# Altium schematic sheet RF.SchDoc: STM32WB55RG RF part
size A4; Author: PhA; SheetNumber: 3; SheetTotal: 6
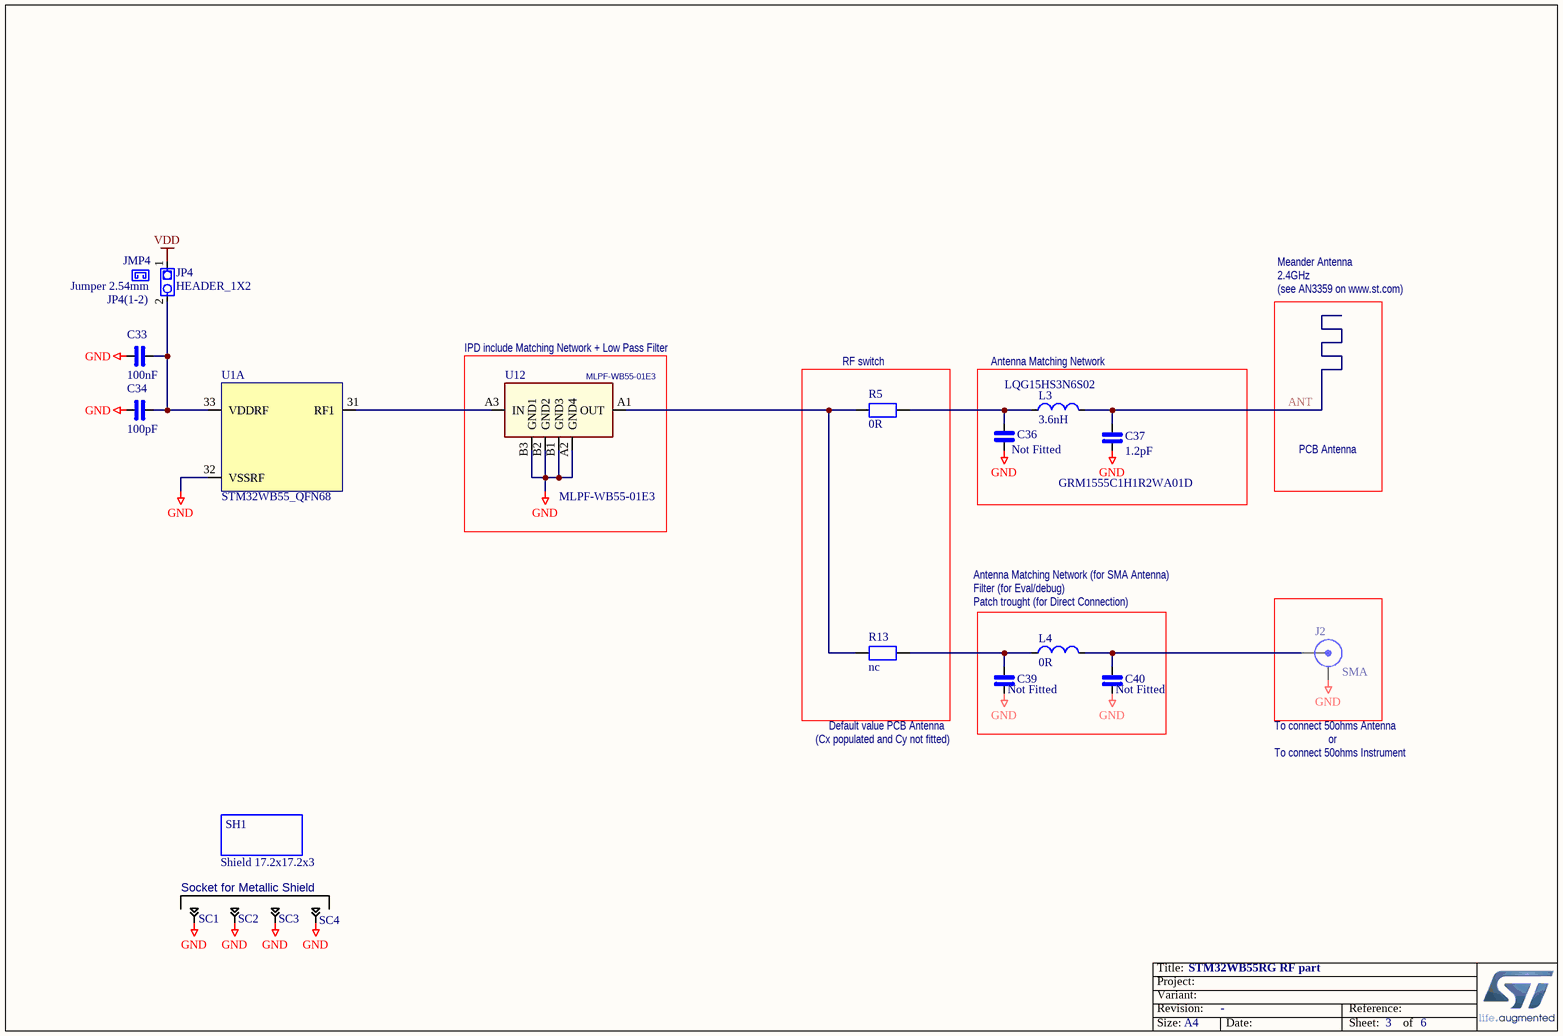
[diagram p0: RF.SchDoc]

## Parts
C33  100nF  [0402_CAP_NPOL]
C34  100pF  [0402_CAP_NPOL]
C36  Fitted: Not Fitted  [0402_CAP_NPOL]
C37  1.2pF  Ref: GRM1555C1H1R2WA01D  [0402_CAP_NPOL]
C39  Fitted: Not Fitted  [0402_CAP_NPOL]
C40  Fitted: Not Fitted  [0402_CAP_NPOL]
J2  SMA  [SMA_T_9.52_NF]
JMP4  Jumper 2.54mm  default: JP4(1-2)  [Jumper 2.54mm BLACK]
JP4  HEADER_1X2  [Header M 1x2x2.54 TH V]
L3  3.6nH  Ref: LQG15HS3N6S02  [0402_COIL]
L4  0R  [0402_COIL]
R5  0R  [0402_RES]
R13  nc  [0402_RES]
SC1  Shield Clip_A 3.9x1.1x1.28  [Shield Clip_A 3.9x1.1x1.28]  (value not drawn)
SC2  Shield Clip_A 3.9x1.1x1.28  [Shield Clip_A 3.9x1.1x1.28]  (value not drawn)
SC3  Shield Clip_A 3.9x1.1x1.28  [Shield Clip_A 3.9x1.1x1.28]  (value not drawn)
SC4  Shield Clip_A 3.9x1.1x1.28  [Shield Clip_A 3.9x1.1x1.28]  (value not drawn)
SH1  Shield 17.2x17.2x3  [Shield 17.2x17.2x3]
U1  STM32WB55_QFN68  [VFQFPN68_8x8x0.1_p0.4]  (part A of 5)
U12  MLPF-WB55-01E3  [ST_CSP650x58P2x3_160x100x42]

## Blocks framed on the sheet
IPD include Matching Network + Low Pass Filter: U12
RF switch: R5 R13
Antenna Matching Network: C36 C37 L3

## Nets
GND: C33.1 C34.1 C36.2 C37.1 C39.1 C40.1 J2.2(Y) SC1.1 SC2.1 SC3.1 SC4.1 U1.32(VSSRF) U12.A2(GND4) U12.B1(GND3) U12.B2(GND2) U12.B3(GND1)
VDD: JP4.1
ANT: C37.2 L3.2
NetC33_2: C33.2 C34.2 JP4.2 U1.33(VDDRF)
NetC36_1: C36.1 L3.1 R5.2
NetC39_2: C39.2 L4.1 R13.2
NetC40_2: C40.2 J2.1(X) L4.2
NetR5_1: R5.1 R13.1 U12.A1(OUT)
NetU1_31: U1.31(RF1) U12.A3(IN)

## Notes on the sheet
- Meander Antenna
- 2.4GHz
- (see AN3359 on www.st.com)
- PCB Antenna
- Antenna Matching Network (for SMA Antenna)
- Filter (for Eval/debug)
- Patch trought (for Direct Connection)
- (near C39) (Cx populated and Cy not fitted)
- Default value PCB Antenna
- To connect 50ohms Antenna
- To connect 50ohms Instrument
- or
- Socket for Metallic Shield
- Title:
- Project:
- Size:
- Revision:
- Variant:
- A4
- -
- Date:
- Reference:
- Sheet:
- of

## Library data of the parts
C33 C34 C36 C37 C39 C40 = CAP_NPOL: Capacitor_not polarized
  C37: Fitted: Fitted
JP4 = HEADER_1X2_L
L3 L4 = INDUCTOR_SMD_STDL
R5 R13 = RES: Resistor
SC1-SC4 = Shield Clip_A 3.9x1.1x1.28: Harwin S0951-46R
SH1 = Shield
U1 = STM32WBxx_QFN68
U12 = MCD-02059: 2.4 GHz low pass filter matched to STM32WBx5Cx/Rx; Part_Type: IC; Manufacturer: STMICROELECTRONICS; ECCN_US: EAR99; ECCN_EU: NEC; Provided_By: SUBCO with ST control; Internal_Part_Number: MCD-02059; Value: MLPF-WB55-01E3; Status: New; Manufacturer_Part_Number: MLPF-WB55-01E3; Package: Bumpless CSP; ComponentLink1Description: Datasheet; ComponentLink1URL: http://tunmcdsvn.tun.st.com/Component_Datasheet_Library/Trunk/IC/STM_Filter_MLPF-WB55-01E3/STM_Filter_MLPF-WB55-01E3.pdf